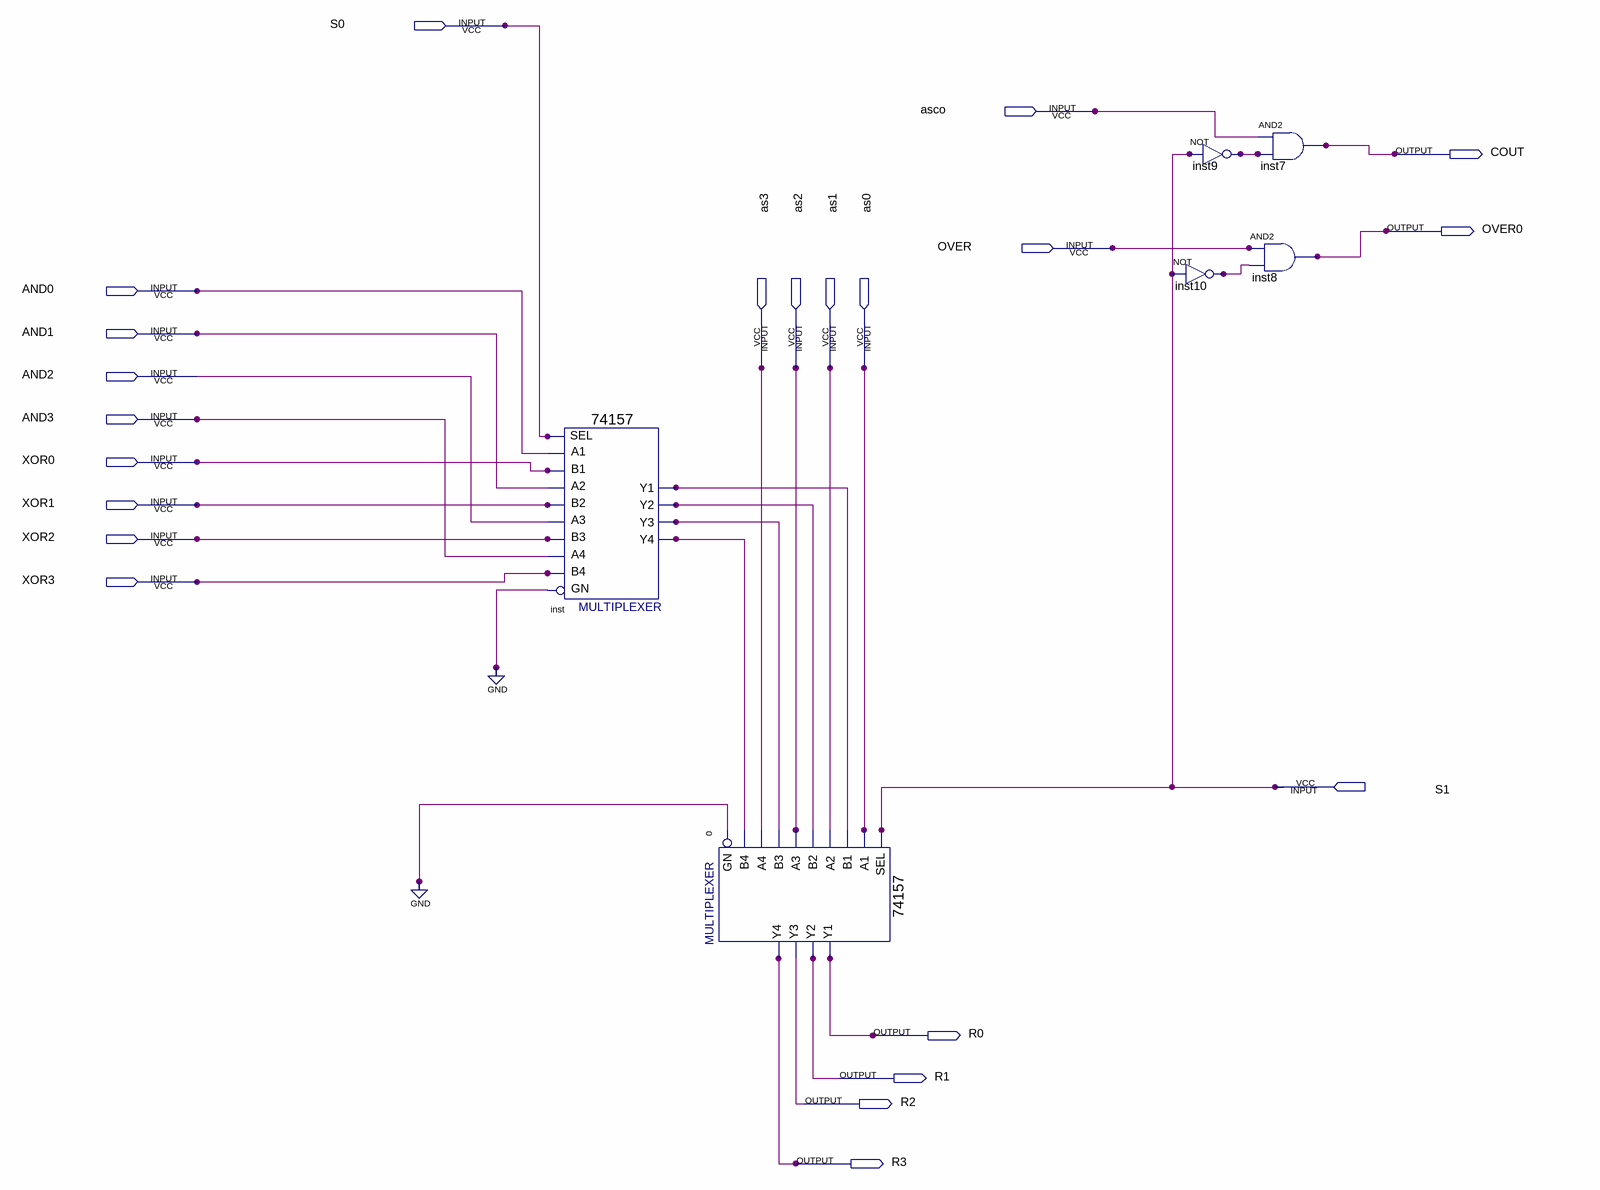
[diagram p0: schematic sheet]
// Quartus schematic ALUMUX.bdf as structural Verilog: 6 symbols, 22 pins
module ALUMUX (
  input  S0,
  input  asco,
  input  OVER,
  input  AND0,
  input  AND1,
  input  as3,
  input  as2,
  input  as1,
  input  as0,
  input  AND2,
  input  AND3,
  input  XOR0,
  input  XOR1,
  input  XOR2,
  input  XOR3,
  input  S1,
  output COUT,
  output OVER0,
  output R0,
  output R1,
  output R2,
  output R3
);

  wire inst9_out, inst10_out, inst_y1, inst_y2, inst_y3, inst_y4;

  \74157  inst (
    .A1(AND0), .B1(XOR0), .SEL(S0), .B2(XOR1), .A3(AND2), .B3(XOR2), .A2(AND1), .B4(XOR3), .GN(1'b0),
    .A4(AND3), .Y2(inst_y2), .Y1(inst_y1), .Y4(inst_y4), .Y3(inst_y3));
  \74157  u_0 (
    .A1(as0), .B1(inst_y1), .SEL(S1), .B2(inst_y2), .A3(as2), .B3(inst_y3), .A2(as1), .B4(inst_y4),
    .GN(1'b0), .A4(as3), .Y2(R1), .Y1(R0), .Y4(R3), .Y3(R2));
  not inst9 (inst9_out, S1);
  not inst10 (inst10_out, S1);
  and inst7 (COUT, asco, inst9_out);
  and inst8 (OVER0, OVER, inst10_out);
endmodule
